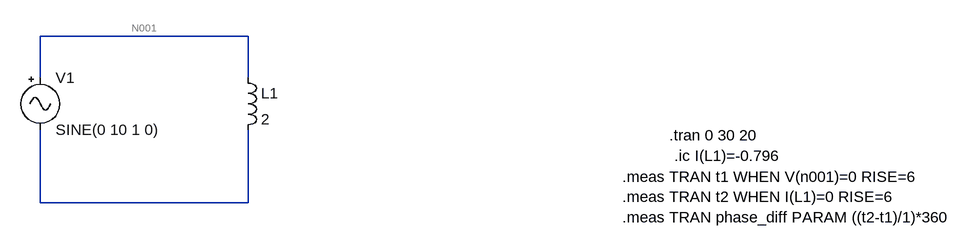
[diagram p0: schematic Analog_inductor.asc]
Analog_inductor.asc, the LTspice schematic file:
Version 4.1
SHEET 1 1260 680
WIRE 128 -112 -192 -112
WIRE -192 -48 -192 -112
WIRE 128 -48 128 -112
WIRE -192 144 -192 32
WIRE 128 144 128 32
WIRE 128 144 -192 144
SYMBOL Misc\\signal -192 -64 R0
WINDOW 123 0 0 Left 0
WINDOW 39 0 0 Left 0
SYMATTR InstName V1
SYMATTR Value SINE(0 10 1 0)
SYMBOL ind 112 -64 R0
SYMATTR InstName L1
SYMATTR Value 2
SYMATTR SpiceLine Rser=1
TEXT 776 40 Left 2 !.tran 0 30 20
TEXT 704 104 Left 2 !.meas TRAN t1 WHEN V(n001)=0 RISE=6\n.meas TRAN t2 WHEN I(L1)=0 RISE=6\n.meas TRAN phase_diff PARAM ((t2-t1)/1)*360
TEXT 784 72 Left 2 !.ic I(L1)=-0.796

The netlist it stands for:
* Analog_inductor.asc
V1 N001 N002 SINE(0 10 1 0)
L1 N001 N002 2 Rser=1
.tran 0 30 20
.meas TRAN t1 WHEN V(n001)=0 RISE=6
.meas TRAN t2 WHEN I(L1)=0 RISE=6
.meas TRAN phase_diff PARAM ((t2-t1)/1)*360
.ic I(L1)=-0.796
.backanno
.end